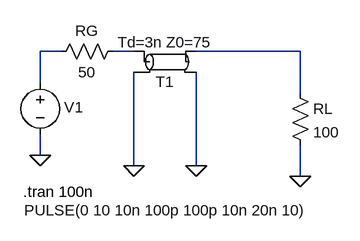
[diagram p0: schematic Actividad_9_2.asc]
Actividad_9_2.asc, the LTspice schematic file:
Version 4
SHEET 1 880 680
WIRE 48 112 16 112
WIRE 160 112 128 112
WIRE 416 112 256 112
WIRE 16 160 16 112
WIRE 416 176 416 112
WIRE 16 272 16 240
WIRE 160 288 160 144
WIRE 256 288 256 144
WIRE 416 304 416 256
FLAG 16 272 0
FLAG 416 304 0
FLAG 160 288 0
FLAG 256 288 0
SYMBOL voltage 16 144 R0
WINDOW 0 37 54 Left 2
WINDOW 3 -25 212 Left 2
WINDOW 123 0 0 Left 2
SYMATTR InstName V1
SYMATTR Value PULSE(0 10 10n 100p 100p 10n 20n 10)
SYMATTR SpiceLine Rser=0
SYMBOL res 32 128 R270
WINDOW 0 32 56 VTop 2
WINDOW 3 0 56 VBottom 2
SYMATTR InstName RG
SYMATTR Value 50
SYMBOL tline 208 128 R0
WINDOW 0 0 46 Bottom 2
WINDOW 3 0 -46 Top 2
SYMATTR InstName T1
SYMATTR Value Td=3n Z0=75
SYMBOL res 400 160 R0
SYMATTR InstName RL
SYMATTR Value 100
TEXT -10 328 Left 2 !.tran 100n

The netlist it stands for:
* Actividad_9_2.asc
V1 N001 0 PULSE(0 10 10n 100p 100p 10n 20n 10) Rser=0
RG N001 N002 50
T1 N002 0 N003 0 Td=3n Z0=75
RL N003 0 100
.tran 100n
.backanno
.end